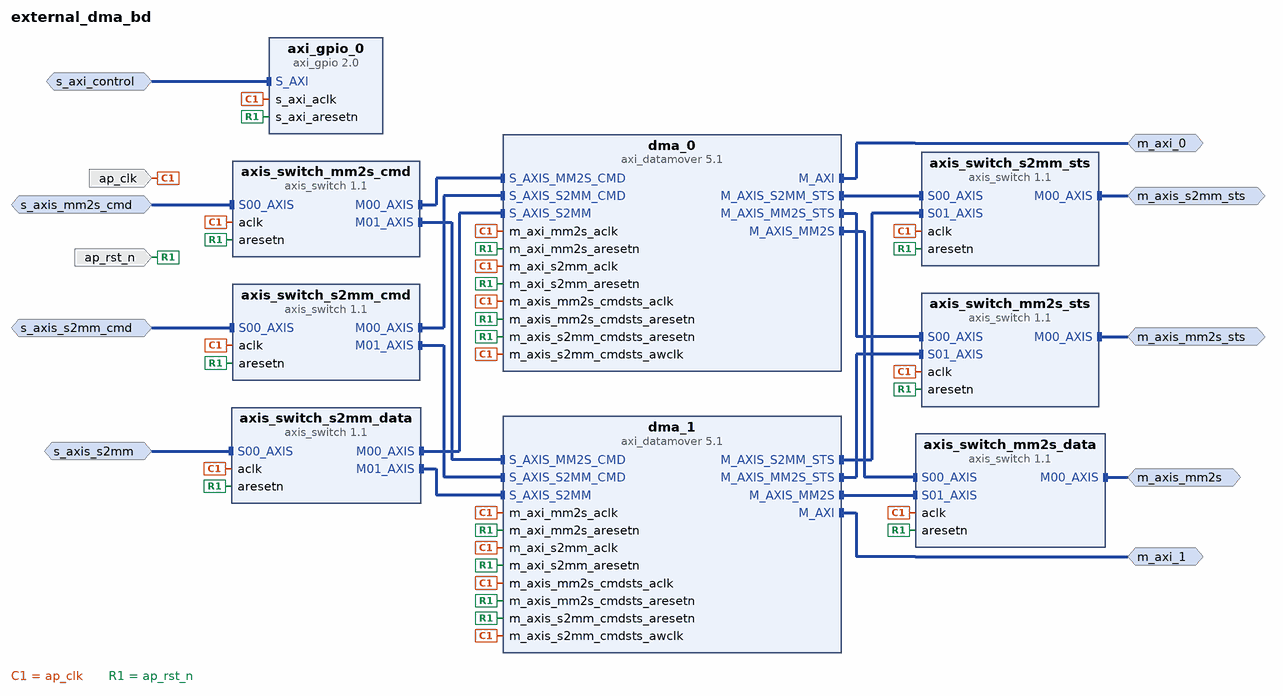
[diagram p0: block diagram of the top level]
# Vivado block design external_dma_bd, xcu280-fsvh2892-2L-e, Vivado 2022.2
create_bd_design external_dma_bd

create_bd_intf_port -mode Slave -vlnv xilinx.com:interface:aximm_rtl:1.0 s_axi_control
set_property -dict [list \
  CONFIG.ADDR_WIDTH 13 \
  CONFIG.ARUSER_WIDTH 0 \
  CONFIG.AWUSER_WIDTH 0 \
  CONFIG.BUSER_WIDTH 0 \
  CONFIG.DATA_WIDTH 32 \
  CONFIG.FREQ_HZ 250000000 \
  CONFIG.HAS_BRESP 1 \
  CONFIG.HAS_BURST 0 \
  CONFIG.HAS_CACHE 0 \
  CONFIG.HAS_LOCK 0 \
  CONFIG.HAS_PROT 1 \
  CONFIG.HAS_QOS 0 \
  CONFIG.HAS_REGION 0 \
  CONFIG.HAS_RRESP 1 \
  CONFIG.HAS_WSTRB 1 \
  CONFIG.ID_WIDTH 0 \
  CONFIG.MAX_BURST_LENGTH 1 \
  CONFIG.NUM_READ_OUTSTANDING 1 \
  CONFIG.NUM_READ_THREADS 1 \
  CONFIG.NUM_WRITE_OUTSTANDING 1 \
  CONFIG.NUM_WRITE_THREADS 1 \
  CONFIG.PROTOCOL AXI4LITE \
  CONFIG.READ_WRITE_MODE READ_WRITE \
  CONFIG.RUSER_BITS_PER_BYTE 0 \
  CONFIG.RUSER_WIDTH 0 \
  CONFIG.SUPPORTS_NARROW_BURST 0 \
  CONFIG.WUSER_BITS_PER_BYTE 0 \
  CONFIG.WUSER_WIDTH 0 \
] [get_bd_intf_ports s_axi_control]
create_bd_intf_port -mode Slave -vlnv xilinx.com:interface:axis_rtl:1.0 s_axis_s2mm
set_property -dict [list \
  CONFIG.FREQ_HZ 250000000 \
  CONFIG.HAS_TKEEP 1 \
  CONFIG.HAS_TLAST 1 \
  CONFIG.HAS_TREADY 1 \
  CONFIG.HAS_TSTRB 0 \
  CONFIG.LAYERED_METADATA undef \
  CONFIG.TDATA_NUM_BYTES 64 \
  CONFIG.TDEST_WIDTH 8 \
  CONFIG.TID_WIDTH 0 \
  CONFIG.TUSER_WIDTH 0 \
] [get_bd_intf_ports s_axis_s2mm]
create_bd_intf_port -mode Master -vlnv xilinx.com:interface:axis_rtl:1.0 m_axis_mm2s
set_property -dict {CONFIG.FREQ_HZ 250000000} [get_bd_intf_ports m_axis_mm2s]
create_bd_intf_port -mode Slave -vlnv xilinx.com:interface:axis_rtl:1.0 s_axis_mm2s_cmd
set_property -dict [list \
  CONFIG.FREQ_HZ 250000000 \
  CONFIG.HAS_TKEEP 1 \
  CONFIG.HAS_TLAST 1 \
  CONFIG.HAS_TREADY 1 \
  CONFIG.HAS_TSTRB 0 \
  CONFIG.LAYERED_METADATA undef \
  CONFIG.TDATA_NUM_BYTES 13 \
  CONFIG.TDEST_WIDTH 8 \
  CONFIG.TID_WIDTH 0 \
  CONFIG.TUSER_WIDTH 0 \
] [get_bd_intf_ports s_axis_mm2s_cmd]
create_bd_intf_port -mode Master -vlnv xilinx.com:interface:axis_rtl:1.0 m_axis_mm2s_sts
set_property -dict {CONFIG.FREQ_HZ 250000000} [get_bd_intf_ports m_axis_mm2s_sts]
create_bd_intf_port -mode Slave -vlnv xilinx.com:interface:axis_rtl:1.0 s_axis_s2mm_cmd
set_property -dict [list \
  CONFIG.FREQ_HZ 250000000 \
  CONFIG.HAS_TKEEP 1 \
  CONFIG.HAS_TLAST 1 \
  CONFIG.HAS_TREADY 1 \
  CONFIG.HAS_TSTRB 0 \
  CONFIG.LAYERED_METADATA undef \
  CONFIG.TDATA_NUM_BYTES 13 \
  CONFIG.TDEST_WIDTH 8 \
  CONFIG.TID_WIDTH 0 \
  CONFIG.TUSER_WIDTH 0 \
] [get_bd_intf_ports s_axis_s2mm_cmd]
create_bd_intf_port -mode Master -vlnv xilinx.com:interface:axis_rtl:1.0 m_axis_s2mm_sts
set_property -dict {CONFIG.FREQ_HZ 250000000} [get_bd_intf_ports m_axis_s2mm_sts]
create_bd_intf_port -mode Master -vlnv xilinx.com:interface:aximm_rtl:1.0 m_axi_0
set_property -dict [list \
  CONFIG.ADDR_WIDTH 64 \
  CONFIG.DATA_WIDTH 512 \
  CONFIG.FREQ_HZ 250000000 \
  CONFIG.HAS_BRESP 0 \
  CONFIG.HAS_BURST 0 \
  CONFIG.HAS_CACHE 0 \
  CONFIG.HAS_LOCK 0 \
  CONFIG.HAS_PROT 0 \
  CONFIG.HAS_QOS 0 \
  CONFIG.HAS_REGION 0 \
  CONFIG.HAS_WSTRB 1 \
  CONFIG.NUM_READ_OUTSTANDING 1 \
  CONFIG.NUM_WRITE_OUTSTANDING 1 \
  CONFIG.PROTOCOL AXI4 \
  CONFIG.READ_WRITE_MODE READ_WRITE \
] [get_bd_intf_ports m_axi_0]
create_bd_intf_port -mode Master -vlnv xilinx.com:interface:aximm_rtl:1.0 m_axi_1
set_property -dict [list \
  CONFIG.ADDR_WIDTH 64 \
  CONFIG.DATA_WIDTH 512 \
  CONFIG.FREQ_HZ 250000000 \
  CONFIG.HAS_BRESP 0 \
  CONFIG.HAS_BURST 0 \
  CONFIG.HAS_CACHE 0 \
  CONFIG.HAS_LOCK 0 \
  CONFIG.HAS_PROT 0 \
  CONFIG.HAS_QOS 0 \
  CONFIG.HAS_REGION 0 \
  CONFIG.HAS_WSTRB 1 \
  CONFIG.NUM_READ_OUTSTANDING 1 \
  CONFIG.NUM_WRITE_OUTSTANDING 1 \
  CONFIG.PROTOCOL AXI4 \
  CONFIG.READ_WRITE_MODE READ_WRITE \
] [get_bd_intf_ports m_axi_1]
create_bd_port -dir I -type clk ap_clk
set_property -dict [list \
  CONFIG.ASSOCIATED_BUSIF s_axi_control:s_axis_s2mm:m_axis_mm2s:s_axis_s2mm_cmd:m_axis_s2mm_sts:s_axis_mm2s_cmd:m_axis_mm2s_sts:m_axi_0:m_axi_1 \
  CONFIG.FREQ_HZ 250000000 \
] [get_bd_ports ap_clk]
create_bd_port -dir I -type rst ap_rst_n

create_bd_cell -type ip -vlnv xilinx.com:ip:axi_gpio:2.0 axi_gpio_0
create_bd_cell -type ip -vlnv xilinx.com:ip:axi_datamover:5.1 dma_0
set_property -dict [list \
  CONFIG.c_addr_width 64 \
  CONFIG.c_dummy 0 \
  CONFIG.c_enable_mm2s 1 \
  CONFIG.c_include_mm2s Full \
  CONFIG.c_include_mm2s_dre true \
  CONFIG.c_include_mm2s_stsfifo true \
  CONFIG.c_include_s2mm_dre true \
  CONFIG.c_m_axi_mm2s_data_width 512 \
  CONFIG.c_m_axi_mm2s_id_width 0 \
  CONFIG.c_m_axi_s2mm_data_width 512 \
  CONFIG.c_m_axi_s2mm_id_width 0 \
  CONFIG.c_m_axis_mm2s_tdata_width 512 \
  CONFIG.c_mm2s_btt_used 23 \
  CONFIG.c_mm2s_burst_size 64 \
  CONFIG.c_mm2s_include_sf true \
  CONFIG.c_s2mm_btt_used 23 \
  CONFIG.c_s2mm_burst_size 64 \
  CONFIG.c_s2mm_support_indet_btt true \
  CONFIG.c_s_axis_s2mm_tdata_width 512 \
  CONFIG.c_single_interface 1 \
] [get_bd_cells dma_0]
create_bd_cell -type ip -vlnv xilinx.com:ip:axi_datamover:5.1 dma_1
set_property -dict [list \
  CONFIG.c_addr_width 64 \
  CONFIG.c_dummy 0 \
  CONFIG.c_enable_mm2s 1 \
  CONFIG.c_include_mm2s Full \
  CONFIG.c_include_mm2s_dre true \
  CONFIG.c_include_mm2s_stsfifo true \
  CONFIG.c_include_s2mm_dre true \
  CONFIG.c_m_axi_mm2s_data_width 512 \
  CONFIG.c_m_axi_mm2s_id_width 0 \
  CONFIG.c_m_axi_s2mm_data_width 512 \
  CONFIG.c_m_axi_s2mm_id_width 0 \
  CONFIG.c_m_axis_mm2s_tdata_width 512 \
  CONFIG.c_mm2s_btt_used 23 \
  CONFIG.c_mm2s_burst_size 64 \
  CONFIG.c_mm2s_include_sf true \
  CONFIG.c_s2mm_btt_used 23 \
  CONFIG.c_s2mm_burst_size 64 \
  CONFIG.c_s2mm_support_indet_btt true \
  CONFIG.c_s_axis_s2mm_tdata_width 512 \
  CONFIG.c_single_interface 1 \
] [get_bd_cells dma_1]
create_bd_cell -type ip -vlnv xilinx.com:ip:axis_switch:1.1 axis_switch_s2mm_data
set_property -dict [list \
  CONFIG.DECODER_REG 1 \
  CONFIG.HAS_TKEEP 1 \
  CONFIG.HAS_TLAST 1 \
  CONFIG.HAS_TSTRB 0 \
  CONFIG.NUM_MI 2 \
  CONFIG.NUM_SI 1 \
  CONFIG.ROUTING_MODE 0 \
  CONFIG.TDATA_NUM_BYTES 64 \
  CONFIG.TDEST_WIDTH 8 \
] [get_bd_cells axis_switch_s2mm_data]
create_bd_cell -type ip -vlnv xilinx.com:ip:axis_switch:1.1 axis_switch_mm2s_data
set_property -dict [list \
  CONFIG.ARB_ALGORITHM 3 \
  CONFIG.ARB_ON_MAX_XFERS 0 \
  CONFIG.ARB_ON_TLAST 1 \
  CONFIG.DECODER_REG 1 \
  CONFIG.HAS_TKEEP 1 \
  CONFIG.HAS_TLAST 1 \
  CONFIG.HAS_TSTRB 0 \
  CONFIG.NUM_MI 1 \
  CONFIG.NUM_SI 2 \
  CONFIG.ROUTING_MODE 0 \
  CONFIG.TDATA_NUM_BYTES 64 \
] [get_bd_cells axis_switch_mm2s_data]
create_bd_cell -type ip -vlnv xilinx.com:ip:axis_switch:1.1 axis_switch_s2mm_cmd
set_property -dict [list \
  CONFIG.DECODER_REG 1 \
  CONFIG.HAS_TKEEP 1 \
  CONFIG.HAS_TLAST 1 \
  CONFIG.HAS_TSTRB 0 \
  CONFIG.NUM_MI 2 \
  CONFIG.NUM_SI 1 \
  CONFIG.ROUTING_MODE 0 \
  CONFIG.TDATA_NUM_BYTES 13 \
  CONFIG.TDEST_WIDTH 8 \
] [get_bd_cells axis_switch_s2mm_cmd]
create_bd_cell -type ip -vlnv xilinx.com:ip:axis_switch:1.1 axis_switch_mm2s_cmd
set_property -dict [list \
  CONFIG.DECODER_REG 1 \
  CONFIG.HAS_TKEEP 1 \
  CONFIG.HAS_TLAST 1 \
  CONFIG.HAS_TSTRB 0 \
  CONFIG.NUM_MI 2 \
  CONFIG.NUM_SI 1 \
  CONFIG.ROUTING_MODE 0 \
  CONFIG.TDATA_NUM_BYTES 13 \
  CONFIG.TDEST_WIDTH 8 \
] [get_bd_cells axis_switch_mm2s_cmd]
create_bd_cell -type ip -vlnv xilinx.com:ip:axis_switch:1.1 axis_switch_mm2s_sts
set_property -dict [list \
  CONFIG.ARB_ALGORITHM 3 \
  CONFIG.ARB_ON_MAX_XFERS 0 \
  CONFIG.ARB_ON_TLAST 1 \
  CONFIG.DECODER_REG 1 \
  CONFIG.HAS_TKEEP 1 \
  CONFIG.HAS_TLAST 1 \
  CONFIG.HAS_TSTRB 0 \
  CONFIG.NUM_MI 1 \
  CONFIG.NUM_SI 2 \
  CONFIG.ROUTING_MODE 0 \
  CONFIG.TDATA_NUM_BYTES 1 \
] [get_bd_cells axis_switch_mm2s_sts]
create_bd_cell -type ip -vlnv xilinx.com:ip:axis_switch:1.1 axis_switch_s2mm_sts
set_property -dict [list \
  CONFIG.ARB_ALGORITHM 3 \
  CONFIG.ARB_ON_MAX_XFERS 0 \
  CONFIG.ARB_ON_TLAST 1 \
  CONFIG.DECODER_REG 1 \
  CONFIG.HAS_TKEEP 1 \
  CONFIG.HAS_TLAST 1 \
  CONFIG.HAS_TSTRB 0 \
  CONFIG.NUM_MI 1 \
  CONFIG.NUM_SI 2 \
  CONFIG.ROUTING_MODE 0 \
  CONFIG.TDATA_NUM_BYTES 4 \
] [get_bd_cells axis_switch_s2mm_sts]

# ---- connections ----

connect_bd_intf_net [get_bd_intf_pins dma_0/S_AXIS_MM2S_CMD] [get_bd_intf_pins axis_switch_mm2s_cmd/M00_AXIS]
connect_bd_intf_net [get_bd_intf_pins dma_1/S_AXIS_MM2S_CMD] [get_bd_intf_pins axis_switch_mm2s_cmd/M01_AXIS]
connect_bd_intf_net [get_bd_intf_ports m_axis_mm2s] [get_bd_intf_pins axis_switch_mm2s_data/M00_AXIS]
connect_bd_intf_net [get_bd_intf_ports m_axis_mm2s_sts] [get_bd_intf_pins axis_switch_mm2s_sts/M00_AXIS]
connect_bd_intf_net [get_bd_intf_pins dma_0/S_AXIS_S2MM_CMD] [get_bd_intf_pins axis_switch_s2mm_cmd/M00_AXIS]
connect_bd_intf_net [get_bd_intf_pins dma_1/S_AXIS_S2MM_CMD] [get_bd_intf_pins axis_switch_s2mm_cmd/M01_AXIS]
connect_bd_intf_net [get_bd_intf_pins dma_0/S_AXIS_S2MM] [get_bd_intf_pins axis_switch_s2mm_data/M00_AXIS]
connect_bd_intf_net [get_bd_intf_pins dma_1/S_AXIS_S2MM] [get_bd_intf_pins axis_switch_s2mm_data/M01_AXIS]
connect_bd_intf_net [get_bd_intf_ports m_axis_s2mm_sts] [get_bd_intf_pins axis_switch_s2mm_sts/M00_AXIS]
connect_bd_intf_net [get_bd_intf_ports m_axi_0] [get_bd_intf_pins dma_0/M_AXI]
connect_bd_intf_net [get_bd_intf_pins dma_0/M_AXIS_MM2S] [get_bd_intf_pins axis_switch_mm2s_data/S00_AXIS]
connect_bd_intf_net [get_bd_intf_pins dma_0/M_AXIS_MM2S_STS] [get_bd_intf_pins axis_switch_mm2s_sts/S00_AXIS]
connect_bd_intf_net [get_bd_intf_pins dma_0/M_AXIS_S2MM_STS] [get_bd_intf_pins axis_switch_s2mm_sts/S00_AXIS]
connect_bd_intf_net [get_bd_intf_ports m_axi_1] [get_bd_intf_pins dma_1/M_AXI]
connect_bd_intf_net [get_bd_intf_pins dma_1/M_AXIS_MM2S] [get_bd_intf_pins axis_switch_mm2s_data/S01_AXIS]
connect_bd_intf_net [get_bd_intf_pins dma_1/M_AXIS_MM2S_STS] [get_bd_intf_pins axis_switch_mm2s_sts/S01_AXIS]
connect_bd_intf_net [get_bd_intf_pins dma_1/M_AXIS_S2MM_STS] [get_bd_intf_pins axis_switch_s2mm_sts/S01_AXIS]
connect_bd_intf_net [get_bd_intf_ports s_axi_control] [get_bd_intf_pins axi_gpio_0/S_AXI]
connect_bd_intf_net [get_bd_intf_ports s_axis_mm2s_cmd] [get_bd_intf_pins axis_switch_mm2s_cmd/S00_AXIS]
connect_bd_intf_net [get_bd_intf_ports s_axis_s2mm] [get_bd_intf_pins axis_switch_s2mm_data/S00_AXIS]
connect_bd_intf_net [get_bd_intf_ports s_axis_s2mm_cmd] [get_bd_intf_pins axis_switch_s2mm_cmd/S00_AXIS]
connect_bd_net [get_bd_ports ap_clk] \
  [get_bd_pins axi_gpio_0/s_axi_aclk] [get_bd_pins dma_0/m_axi_mm2s_aclk] [get_bd_pins dma_0/m_axi_s2mm_aclk] \
  [get_bd_pins dma_0/m_axis_s2mm_cmdsts_awclk] [get_bd_pins dma_0/m_axis_mm2s_cmdsts_aclk] \
  [get_bd_pins dma_1/m_axi_mm2s_aclk] [get_bd_pins dma_1/m_axi_s2mm_aclk] [get_bd_pins dma_1/m_axis_s2mm_cmdsts_awclk] \
  [get_bd_pins dma_1/m_axis_mm2s_cmdsts_aclk] [get_bd_pins axis_switch_mm2s_cmd/aclk] [get_bd_pins axis_switch_mm2s_sts/aclk] \
  [get_bd_pins axis_switch_s2mm_cmd/aclk] [get_bd_pins axis_switch_s2mm_sts/aclk] [get_bd_pins axis_switch_s2mm_data/aclk] \
  [get_bd_pins axis_switch_mm2s_data/aclk]
connect_bd_net [get_bd_ports ap_rst_n] \
  [get_bd_pins axi_gpio_0/s_axi_aresetn] [get_bd_pins dma_0/m_axi_mm2s_aresetn] [get_bd_pins dma_0/m_axi_s2mm_aresetn] \
  [get_bd_pins dma_0/m_axis_s2mm_cmdsts_aresetn] [get_bd_pins dma_0/m_axis_mm2s_cmdsts_aresetn] \
  [get_bd_pins dma_1/m_axi_mm2s_aresetn] [get_bd_pins dma_1/m_axi_s2mm_aresetn] \
  [get_bd_pins dma_1/m_axis_s2mm_cmdsts_aresetn] [get_bd_pins dma_1/m_axis_mm2s_cmdsts_aresetn] \
  [get_bd_pins axis_switch_mm2s_cmd/aresetn] [get_bd_pins axis_switch_mm2s_sts/aresetn] \
  [get_bd_pins axis_switch_s2mm_cmd/aresetn] [get_bd_pins axis_switch_s2mm_sts/aresetn] \
  [get_bd_pins axis_switch_s2mm_data/aresetn] [get_bd_pins axis_switch_mm2s_data/aresetn]

# ---- address map ----
assign_bd_address -offset 0x0000000000000000 -range 16E -target_address_space [get_bd_addr_spaces dma_0/Data] [get_bd_addr_segs m_axi_0/Reg]
assign_bd_address -offset 0x0000000000000000 -range 16E -target_address_space [get_bd_addr_spaces dma_1/Data] [get_bd_addr_segs m_axi_1/Reg]
assign_bd_address -offset 0x0000 -range 4K -target_address_space [get_bd_addr_spaces s_axi_control] [get_bd_addr_segs axi_gpio_0/S_AXI/Reg]

validate_bd_design
save_bd_design
